# EAGLE design joysticks_left (EAGLE 6.4)
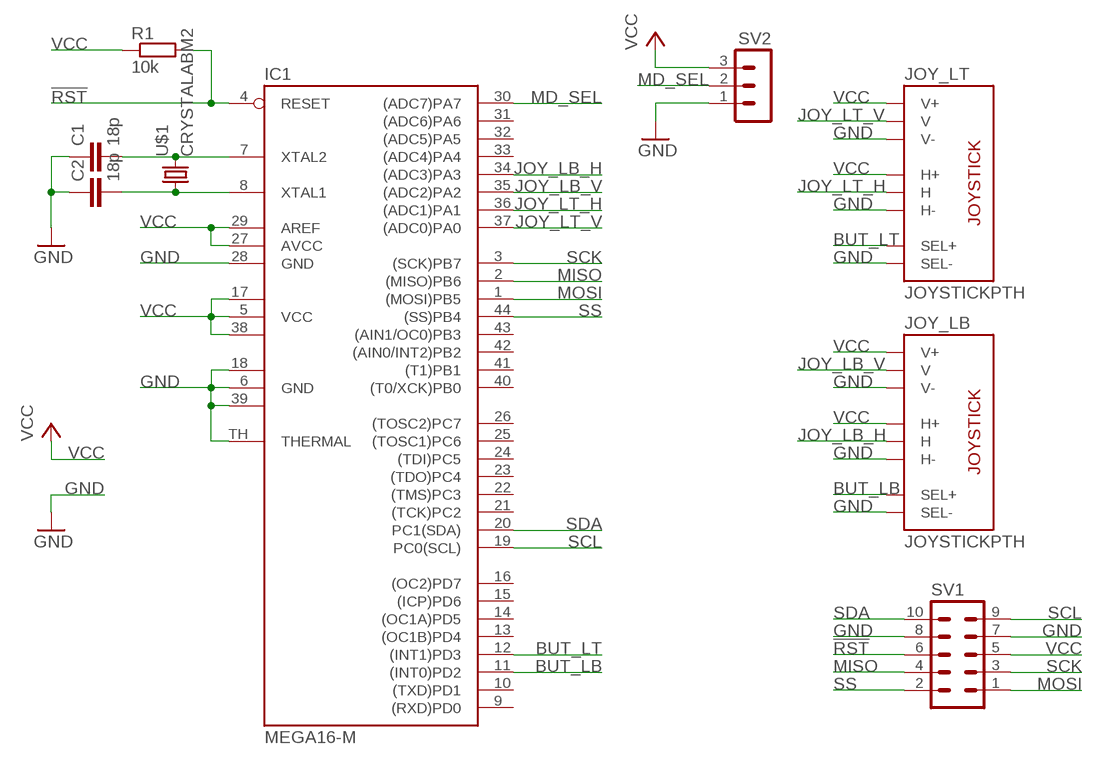
[diagram p0: schematic, sheet 1]

## Parts
C1  18p  C-EUC0603  [C0603]
C2  18p  C-EUC0603  [C0603]
IC1  MEGA16-M  [MLF44-TH]
JOY_LB  JOYSTICKPTH  [JOYSTICK]
JOY_LT  JOYSTICKPTH  [JOYSTICK]
R1  10k  R-EU_R0603  [R0603]
SV1  MA05-2  [MA05-2]
SV2  MA03-1  [MA03-1]
U$1  CRYSTALABM2  [ABM2]

## Nets
!RST: IC1.4(RESET) R1.2 SV1.6
BUT_LB: IC1.11((INT0)PD2) JOY_LB.B1A(SEL+)
BUT_LT: IC1.12((INT1)PD3) JOY_LT.B1A(SEL+)
GND: C1.1 C2.1 IC1.6(GND) IC1.18(GND1) IC1.28(GND) IC1.39(GND2) IC1.TH(THERMAL) JOY_LB.B2A(SEL-) JOY_LB.H3(H-) JOY_LB.V3(V-) JOY_LT.B2A(SEL-) JOY_LT.H3(H-) JOY_LT.V3(V-) SV1.7 SV1.8 SV2.1
JOY_LB_H: IC1.34((ADC3)PA3) JOY_LB.H2(H)
JOY_LB_V: IC1.35((ADC2)PA2) JOY_LB.V2(V)
JOY_LT_H: IC1.36((ADC1)PA1) JOY_LT.H2(H)
JOY_LT_V: IC1.37((ADC0)PA0) JOY_LT.V2(V)
MD_SEL: IC1.30((ADC7)PA7) SV2.2
MISO: IC1.2((MISO)PB6) SV1.4
MOSI: IC1.1((MOSI)PB5) SV1.1
N$1: C1.2 IC1.7(XTAL2) U$1.P$2
N$2: C2.2 IC1.8(XTAL1) U$1.P$1
SCK: IC1.3((SCK)PB7) SV1.3
SCL: IC1.19(PC0(SCL)) SV1.9
SDA: IC1.20(PC1(SDA)) SV1.10
SS: IC1.44((SS)PB4) SV1.2
VCC: IC1.5(VCC) IC1.17(VCC1) IC1.27(AVCC) IC1.29(AREF) IC1.38(VCC2) JOY_LB.H1(H+) JOY_LB.V1(V+) JOY_LT.H1(H+) JOY_LT.V1(V+) R1.1 SV1.5 SV2.3
Unconnected: IC1.9((RXD)PD0) IC1.10((TXD)PD1) IC1.13((OC1B)PD4) IC1.14((OC1A)PD5) IC1.15((ICP)PD6) IC1.16((OC2)PD7) IC1.21((TCK)PC2) IC1.22((TMS)PC3) IC1.23((TDO)PC4) IC1.24((TDI)PC5) IC1.25((TOSC1)PC6) IC1.26((TOSC2)PC7) IC1.31((ADC6)PA6) IC1.32((ADC5)PA5) IC1.33((ADC4)PA4) IC1.40((T0/XCK)PB0) IC1.41((T1)PB1) IC1.42((AIN0/INT2)PB2) IC1.43((AIN1/OC0)PB3)

## Library data of the parts
C1 C2 = rcl:C-EU: CAPACITOR, European symbol
IC1 = atmel:MEGA16-M: MICROCONTROLLER 16 Kbytes FLASH 1 kbytes SRAM 512 bytes EEPROM USART 8-channel 10 bit ADC Source: avr.lbr; MPN: ATMEGA16-16MU; OC_FARNELL: 1455097; OC_NEWARK: 58M3723
JOY_LB JOY_LT = SparkFun-Electromechanical:JOYSTICK: Thumb Joystick Joystick commonly found in PS2 controllers. Two pots and a select switch. Footprint proven. Spark Fun Electronics SKU : COM-09032
R1 = rcl:R-EU_: RESISTOR, European symbol
SV1 = con-lstb:MA05-2: PIN HEADER; OC_FARNELL: unknown; OC_NEWARK: unknown
SV2 = con-lstb:MA03-1: PIN HEADER; OC_FARNELL: unknown; OC_NEWARK: unknown
U$1 = jocki:CRYSTAL

## Board
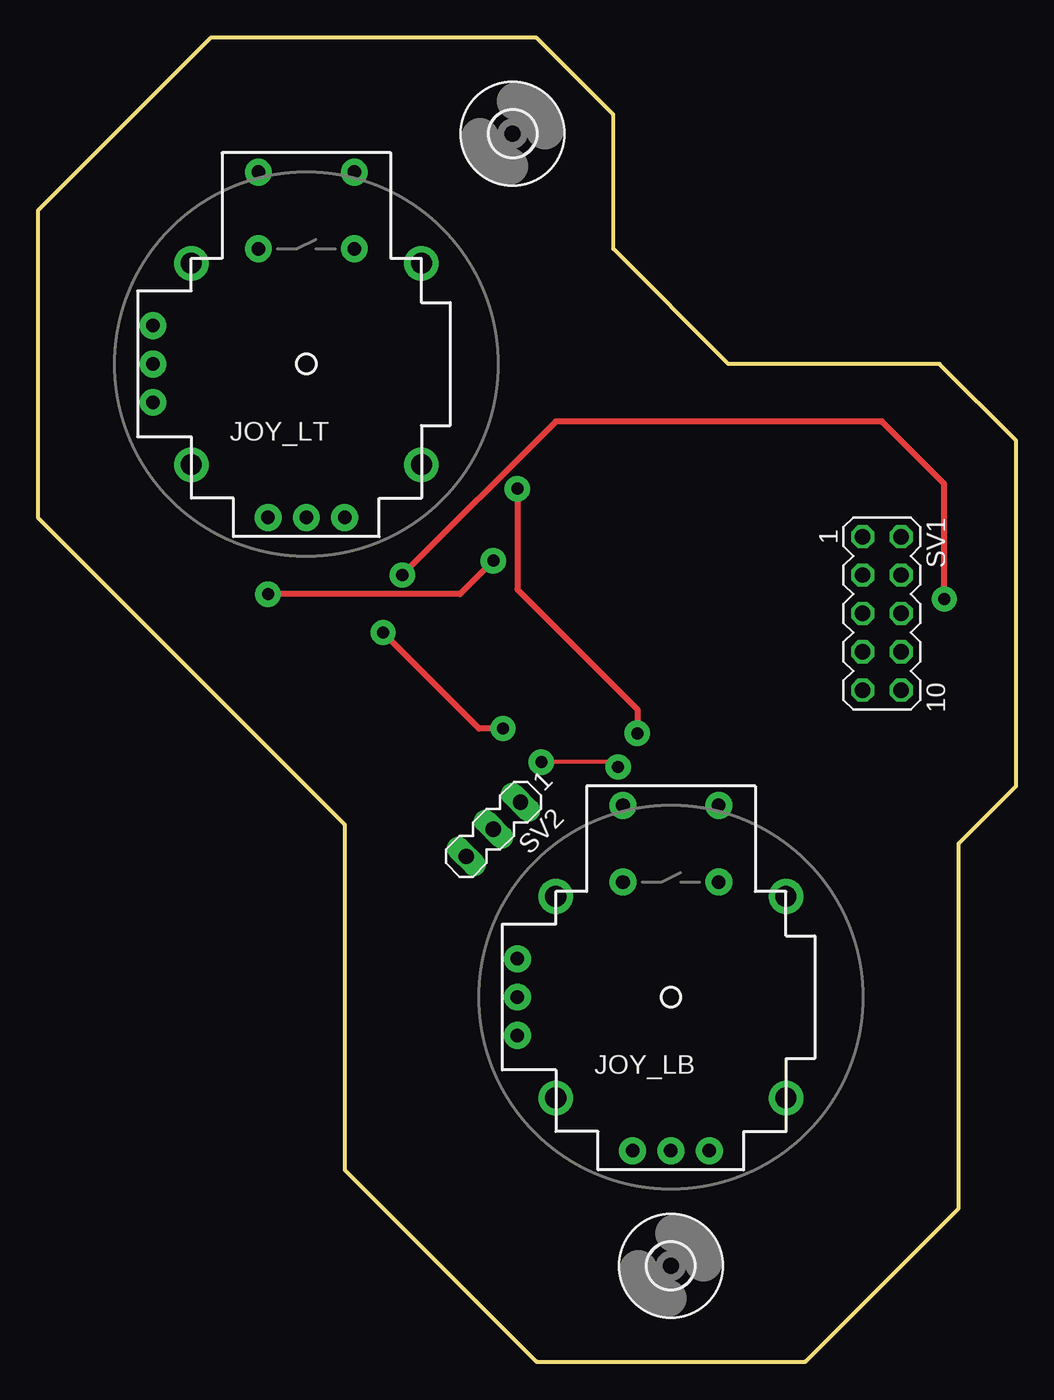
[diagram p1: board, top side]
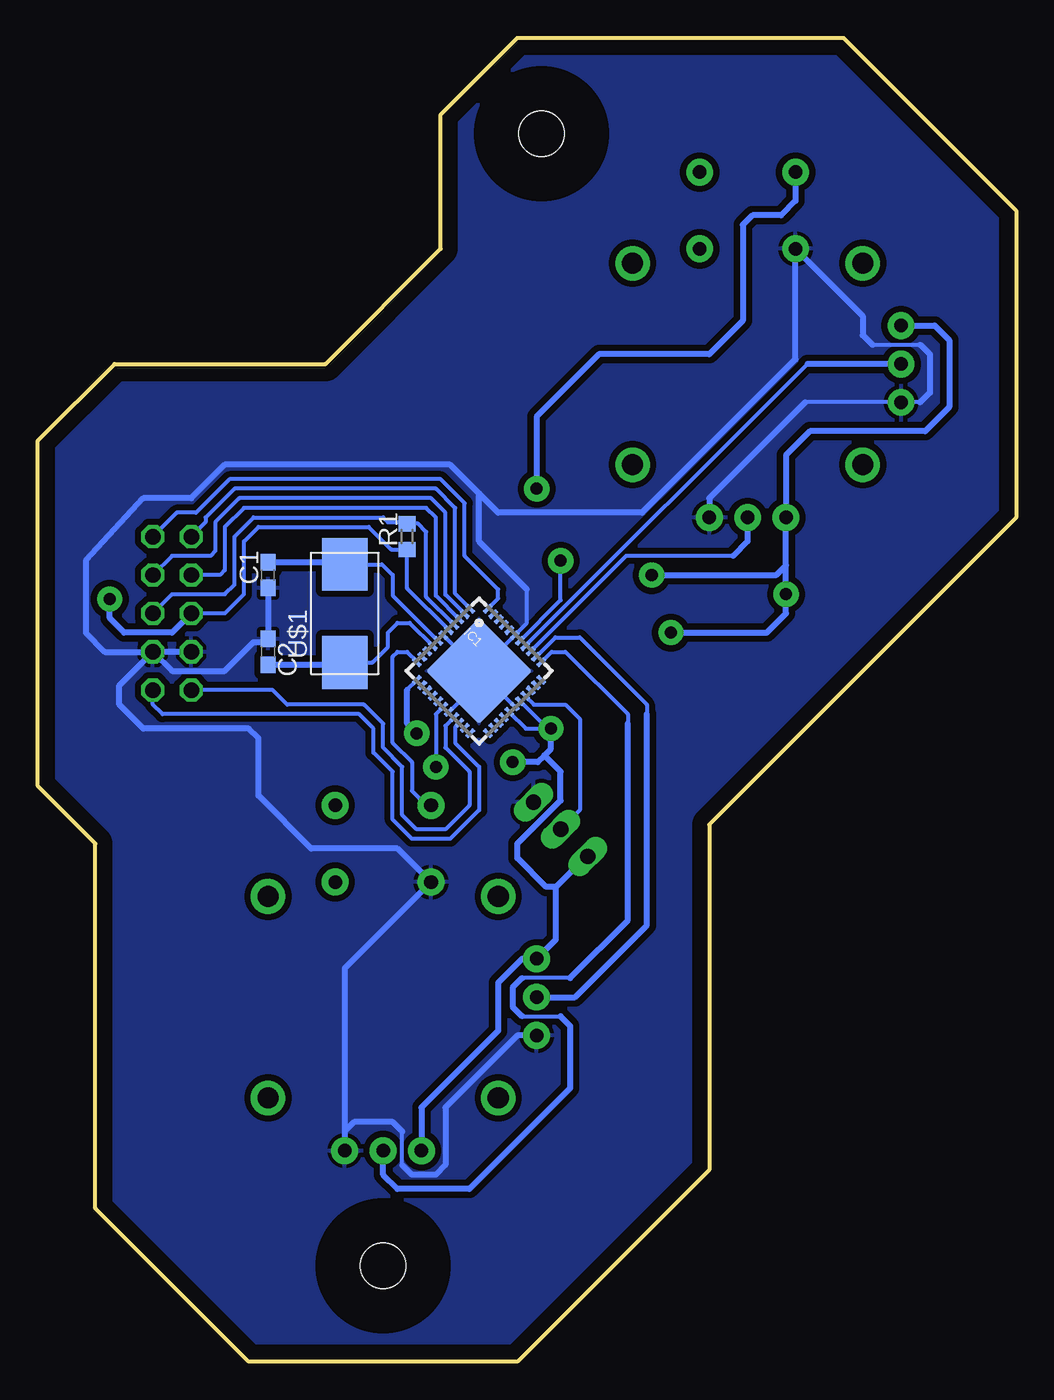
[diagram p2: board, bottom side, seen from below]

Size 64.77 x 87.63 mm. Coordinates in mm from the lower left corner, seen from the top.
Outline: 11.43,87.63 0,76.2 0,55.88 20.32,35.56 20.32,12.7 33.02,0 50.8,0 60.96,10.16 60.96,34.29 64.77,38.1 64.77,60.96 59.69,66.04 45.72,66.04 38.1,73.66 38.1,82.55 33.02,87.63 11.43,87.63
Copper layers (1*16): Top 0.035mm / dielectric 1.5mm / Bottom 0.035mm
Design rules "default": minimum track width 10mil, minimum drill 24mil, track to track 8mil, track to pad 8mil, pad to pad 8mil, via to via 8mil, smd to smd 8mil, copper to edge 40mil, drill to drill 8mil, minimum pad ring 10mil, minimum via ring 8mil, stop-mask expansion 4mil, vias tented up to drill 0mil, thermal gap 10mil

### Footprints (pad centres in the part's own frame; a part is rotated, then mirrored left to right if it is on the bottom)
C0603 = smd 1.1 x 1: 1 -0.85,0; 2 0.85,0
MLF44-TH = smd 0.7 x 0.3: 1 -3.325,2.5; 2 -3.325,2; 3 -3.325,1.5; 4 -3.325,1; 5 -3.325,0.5; 6 -3.325,0; 7 -3.325,-0.5; 8 -3.325,-1; 9 -3.325,-1.5; 10 -3.325,-2; 11 -3.325,-2.5; 23 3.325,-2.5; 24 3.325,-2; 25 3.325,-1.5; 26 3.325,-1; 27 3.325,-0.5; 28 3.325,0; 29 3.325,0.5; 30 3.325,1; 31 3.325,1.5; 32 3.325,2; 33 3.325,2.5 | smd 0.3 x 0.7: 12 -2.5,-3.325; 13 -2,-3.325; 14 -1.5,-3.325; 15 -1,-3.325; 16 -0.5,-3.325; 17 0,-3.325; 18 0.5,-3.325; 19 1,-3.325; 20 1.5,-3.325; 21 2,-3.325; 22 2.5,-3.325; 34 2.5,3.325; 35 2,3.325; 36 1.5,3.325; 37 1,3.325; 38 0.5,3.325; 39 0,3.325; 40 -0.5,3.325; 41 -1,3.325; 42 -1.5,3.325; 43 -2,3.325; 44 -2.5,3.325 | smd 5 x 5: TH 0,0
JOYSTICK = drill 0.9 pad 1.778: B1A -3.175,12.7; B1B 3.175,12.7; B2A -3.175,7.62; B2B 3.175,7.62 | drill 0.889 pad 1.778: H1 -2.54,-10.16; H2 0,-10.16; H3 2.54,-10.16; V1 -10.16,2.54; V2 -10.16,0; V3 -10.16,-2.54 | drill 1.397 pad 2.286: MOUNT1 -7.62,6.668; MOUNT2 -7.62,-6.668; MOUNT3 7.62,-6.668; MOUNT4 7.62,6.668
R0603 = smd 1 x 1.1: 1 -0.85,0; 2 0.85,0
MA05-2 = drill 1.016 octagon: 1 -5.08,-1.27; 2 -5.08,1.27; 3 -2.54,-1.27; 4 -2.54,1.27; 5 0,-1.27; 6 0,1.27; 7 2.54,-1.27; 8 2.54,1.27; 9 5.08,-1.27; 10 5.08,1.27
MA03-1 = drill 1.016 long: 1 -2.54,0; 2 0,0; 3 2.54,0
ABM2 = smd 3.5 x 3: P$1 -3.25,0; P$2 3.25,0
3,0 = hole 3: 0,0

### Placement (x,y rotation side)
C1  49.53,52.07 90 bottom
C2  49.53,46.99 270 bottom
IC1  35.56,45.72 315 bottom
JOY_LB  41.91,24.13 0 top
JOY_LT  17.78,66.04 0 top
R1  40.32,54.61 90 bottom
SV1  55.88,49.53 270 top
SV2  30.16,35.24 225 top
U$1  44.45,49.53 90 bottom
U$2  [3,0]  31.43,81.28 0 top
U$3  [3,0]  41.91,6.35 0 top

### Tracks (layer width: path | path; a pad name or v marks a point on that pad's centre or on a via)
!RST
  Bottom 0.254: IC1.4 39.05,50.63 39.05,54.93 39.59,55.46 R1.2 40.43,55.56 41.59,55.56 41.91,55.88 50.48,55.88 51.75,54.61 51.75,51.44 52.39,50.8 55.88,50.8 SV1.6
BUT_LB
  Bottom 0.254: IC1.11 39.68,46.35 40.32,46.99 40.96,46.99 41.28,46.67 41.28,40.96 40.01,39.69 40.01,37.78 39.05,36.83 JOY_LB.B1A
BUT_LT  (via drill 0.8 pad 1.68)
  Top 0.406: v31.75,57.79 31.75,51.12 39.69,43.18 v39.69,41.59
  Bottom 0.254: 40.32,44.49 IC1.12
  Bottom 0.406: JOY_LT.B1A 14.61,76.84 15.56,75.88 17.46,75.88 18.1,75.25 18.1,68.9 20.32,66.67 27.62,66.67 31.75,62.55 v31.75,57.79 | v39.69,41.59 40.32,42.23 40.32,44.49
GND
  Bottom 0.254: 49.75,47.62 C2.1 | 9.53,67.31 6.35,67.31 | 6.35,63.5 JOY_LT.V3 13.97,63.5 | 40.64,13.02 40.64,15.24 | IC1.28 IC1.TH | IC1.TH | IC1.6 IC1.TH | IC1.TH | IC1.TH IC1.39 32.38,48.9 32.38,51.12 | IC1.18 35.56,45.01 IC1.TH
  Bottom 0.406: C1.1 C2.1 | SV1.8 55.88,45.72 52.39,45.72 50.48,47.62 49.75,47.62 | SV1.7 SV1.8 | 9.53,67.31 10.16,67.95 10.16,69.22 JOY_LT.B2A 14.61,66.36 24.77,56.2 34.29,56.2 35.56,57.47 | 6.35,67.31 5.71,66.67 5.71,64.14 6.35,63.5 | 13.97,63.5 20.32,57.15 JOY_LT.H3 | JOY_LB.V3 33.02,21.59 37.78,16.83 37.78,13.02 38.42,12.38 40.01,12.38 40.64,13.02 | 40.64,15.24 41.28,15.88 43.82,15.88 44.45,15.24 JOY_LB.H3 44.45,26.04 JOY_LB.B2A 40.96,33.97 46.67,33.97 50.17,37.47 50.17,41.28 50.8,41.91 57.79,41.91 59.37,43.5 59.37,44.77 SV1.8 | 32.38,51.12 35.56,54.29 35.56,57.47 | 35.56,57.47 37.47,59.37 52.39,59.37 54.61,57.15 57.79,57.15 61.6,53.02 61.6,48.26 60.33,46.99 SV1.8
  pour Bottom (isolate 0.406): 0,76.2 0,55.88 20.32,35.56 20.32,12.7 33.02,0 50.8,0 60.96,10.16 60.96,34.29 64.77,38.1 64.77,60.96 59.69,66.04 45.72,66.04 38.1,73.66 38.1,82.55 33.02,87.63 11.43,87.63
JOY_LB_H
  Bottom 0.254: 31.44,46.35 IC1.34 30.75,46.99 29.84,46.99 25.72,42.86 25.72,42.23 | 29.53,25.4 32.7,25.4 | 32.7,22.86 30.16,22.86
  Bottom 0.406: 25.72,42.23 25.72,29.21 29.53,25.4 | 32.7,25.4 33.34,24.76 33.34,23.49 32.7,22.86 | 30.16,22.86 29.53,22.22 29.53,18.1 36.2,11.43 40.96,11.43 41.91,12.38 JOY_LB.H2
JOY_LB_V
  Bottom 0.254: IC1.35 30.51,47.94 28.89,47.94 24.45,43.5 24.45,42.86
  Bottom 0.406: JOY_LB.V2 29.21,24.13 24.45,28.89 24.45,42.86
JOY_LT_H
  Bottom 0.254: 18.73,53.34 25.82,53.34 IC1.36
  Bottom 0.406: JOY_LT.H2 17.78,54.29 18.73,53.34
JOY_LT_V
  Bottom 0.254: 13.83,66.04 IC1.37
  Bottom 0.406: JOY_LT.V2 13.83,66.04
MD_SEL
  Bottom 0.254: IC1.30 31.92,43.5 29.84,43.5 28.89,42.55 28.89,36.51 SV2.2
MISO
  Bottom 0.254: IC1.2 37.78,50.77 37.78,56.2 38.74,57.15 51.44,57.15 53.02,55.56 53.02,53.66 53.34,53.34 55.88,53.34 SV1.4
MOSI
  Bottom 0.254: IC1.1 37.15,50.84 37.15,56.52 38.42,57.79 51.75,57.79 53.66,55.88 53.66,55.56 SV1.1
N$1
  Bottom 0.254: U$1.P$2 41.99,52.78 41.28,52.07 41.28,50.73 IC1.7
  Bottom 0.406: C1.2 44.45,52.92 U$1.P$2
N$2
  Bottom 0.254: U$1.P$1 42.62,46.28 41.59,47.31 41.59,48.26 40.96,48.9 40.15,48.9 IC1.8
  Bottom 0.406: C2.2 44.45,46.14 U$1.P$1
SCK
  Bottom 0.254: IC1.3 38.42,50.7 38.42,55.88 39.05,56.52 51.12,56.52 52.39,55.25 52.39,52.39 52.71,52.07 SV1.3
SCL
  Bottom 0.254: IC1.19 37.78,42.08 37.78,40.64 36.2,39.05 36.2,36.83 37.78,35.24 39.69,35.24 40.64,36.2 40.64,39.37 41.91,40.64 41.91,42.23 43.18,43.5 48.26,43.5 49.21,44.45 SV1.9
SDA
  Bottom 0.254: IC1.20 37.15,42.01 37.15,40.96 35.56,39.37 35.56,36.51 37.47,34.61 40.01,34.61 41.28,35.88 41.28,39.05 42.55,40.32 42.55,41.91 43.5,42.86 56.52,42.86 57.15,43.5 SV1.10
SS
  Bottom 0.254: IC1.44 34.29,50.53 34.29,51.12 36.51,53.34 36.51,56.83 38.1,58.42 52.07,58.42 54.29,56.2 55.56,56.2 SV1.2
VCC  (via drill 0.8 pad 1.68)
  Top 0.254: v38.42,39.37 38.1,39.69 v33.34,39.69
  Top 0.406: v30.16,53.02 27.94,50.8 v15.24,50.8 | v60.01,50.48 60.01,58.1 55.88,62.23 34.29,62.23 v24.13,52.07 | v30.8,41.91 29.21,41.91 v22.86,48.26
  Bottom 0.254: IC1.5 40.32,51.19 R1.1 41.38,53.76 42.86,55.25 50.17,55.25 51.12,54.29 51.12,50.8 52.39,49.53 SV1.5 | IC1.38 30.16,50.41 v30.16,53.02 | IC1.17 38.42,42.86 v38.42,39.37 | IC1.29 31.04,41.91 v30.8,41.91 32.46,41.91 IC1.27
  Bottom 0.406: JOY_LT.V1 5.4,68.58 4.45,67.63 4.45,63.18 6.03,61.59 13.65,61.59 15.24,60.01 JOY_LT.H1 15.24,52.71 | JOY_LB.H1 39.37,16.83 34.29,21.91 34.29,25.08 32.7,26.67 JOY_LB.V1 30.48,27.94 30.48,31.43 | 15.24,52.71 v15.24,50.8 15.24,49.53 16.51,48.26 v22.86,48.26 | SV1.5 55.88,48.26 59.05,48.26 60.01,49.21 v60.01,50.48 | v24.13,52.07 15.88,52.07 15.24,52.71 | v30.8,41.91 30.8,40.57 31.24,40.13 | 31.24,40.13 31.68,39.69 v33.34,39.69 | SV2.3 28.47,33.45 30.48,31.43 | 30.48,31.43 31.11,31.43 33.02,33.34 33.02,34.29 30.16,37.15 30.16,39.05 31.24,40.13 | 31.24,40.13